# EAGLE design WizFi_Baseboard (EAGLE 6.1)
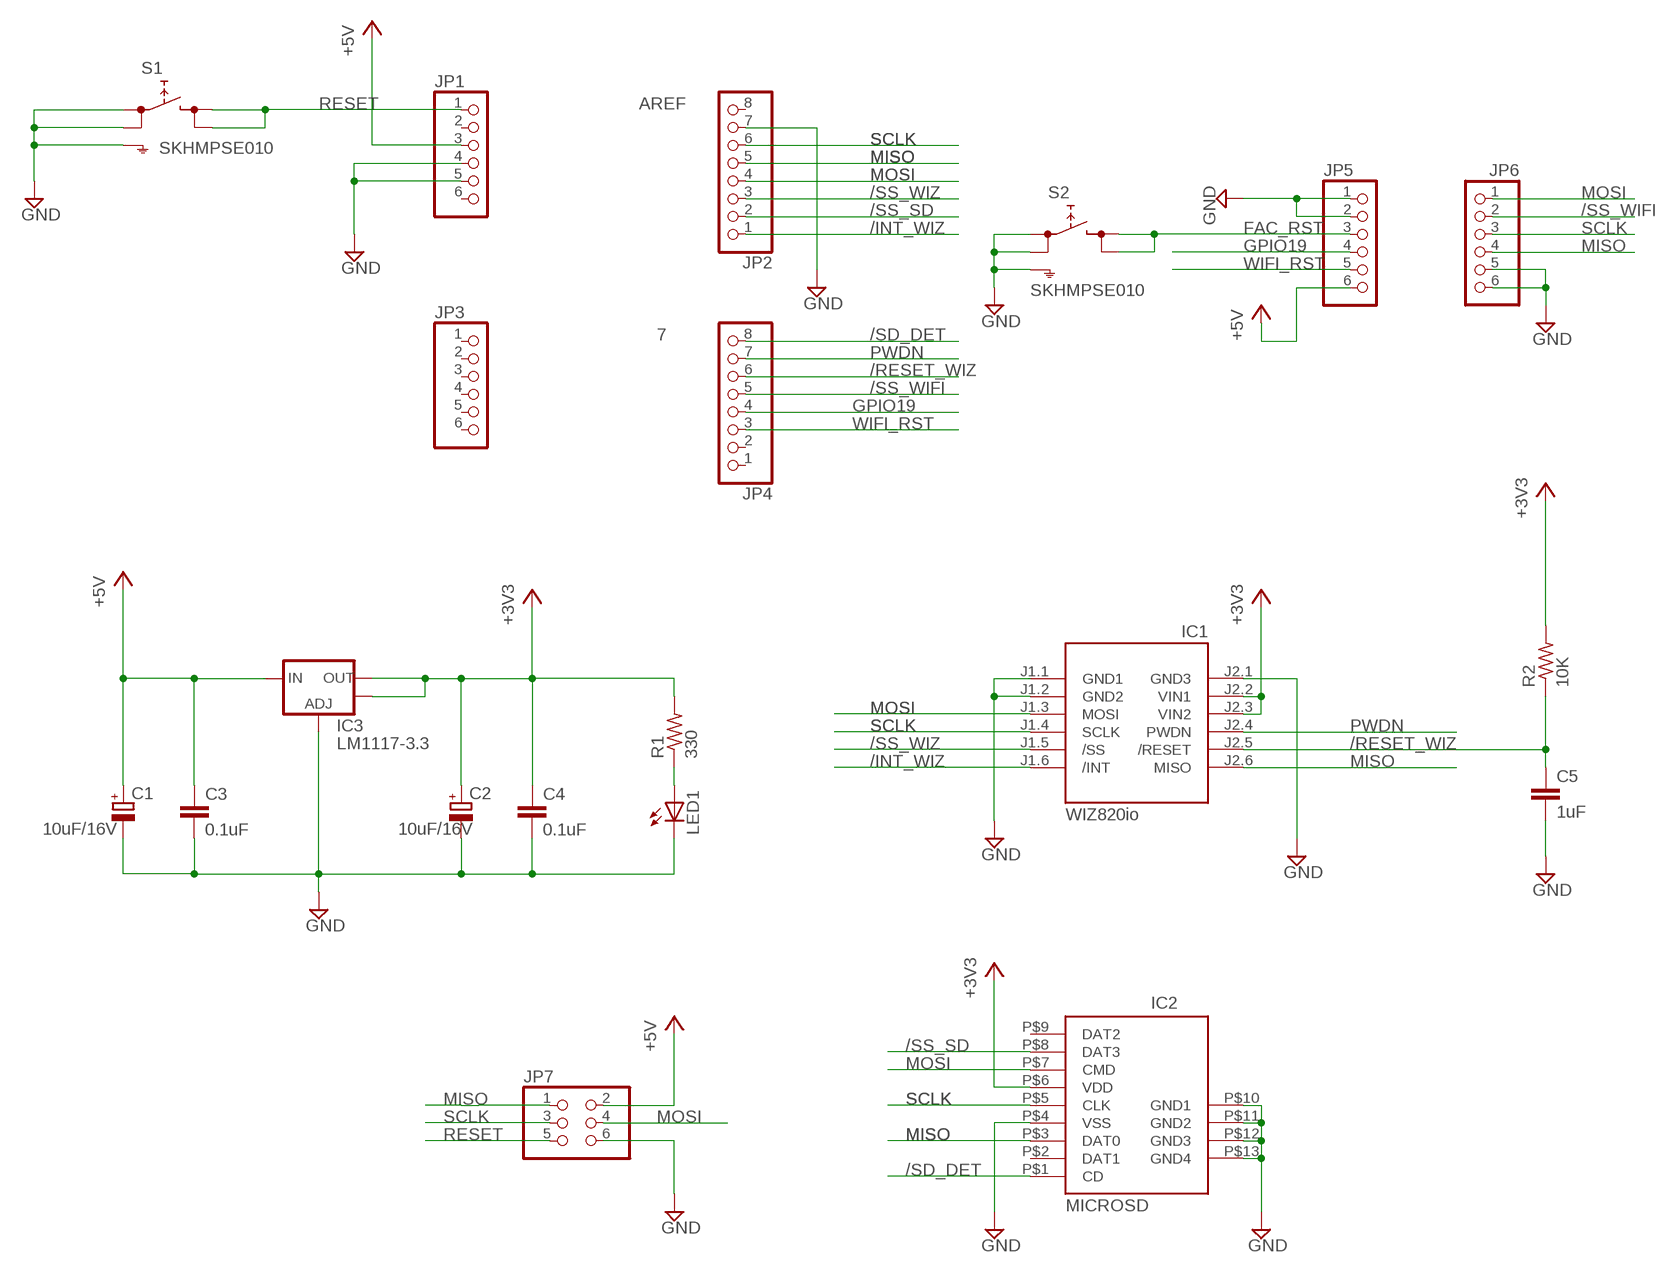
[diagram p0: schematic, sheet 1]

## Parts
C1  10uF/16V  CPOL-EUCT3216  [CT3216]
C2  10uF/16V  CPOL-EUCT3216  [CT3216]
C3  0.1uF  C-EUC0805  [C0805]
C4  0.1uF  C-EUC0805  [C0805]
C5  1uF  C-EUC0805  [C0805]
IC1  WIZ820io  WIZ820IO_DEVICE'DUAL-IN-LINE-STAMP'  [WIZ820IO]
IC2  MICROSD  [MSDPAC]
IC3  LM1117-3.3  V_REG_LM1117SOT223  [SOT223]
JP1  PINHD-1X6  [1X06]
JP2  PINHD-1X8  [1X08]
JP3  PINHD-1X6  [1X06]
JP4  PINHD-1X8  [1X08]
JP5  PINHD-1X6  [1X06]
JP6  PINHD-1X6  [1X06]
JP7  PINHD-2X3  [2X03]
LED1  LEDCHIP-LED0805  [CHIP-LED0805]
R1  330  R-US_R0805  [R0805]
R2  10K  R-US_R0805  [R0805]
S1  SKHMPSE010  [SKHMPXE010]
S2  SKHMPSE010  [SKHMPXE010]

## Nets
+3V3: C2.+ C4.1 IC1.J2.2(VIN1) IC1.J2.3(VIN2) IC2.P$6(VDD) IC3.2(OUT) IC3.4(OUT) R1.2 R2.2
+5V: C1.+ C3.1 IC3.3(IN) JP1.3 JP5.6 JP7.2
/INT_WIZ: IC1.J1.6(/INT) JP2.1
/RESET_WIZ: C5.1 IC1.J2.5(/RESET) JP4.6 R2.1
/SD_DET: IC2.P$1(CD) JP4.8
/SS_SD: IC2.P$8(DAT3) JP2.2
/SS_WIFI: JP4.5 JP6.2
/SS_WIZ: IC1.J1.5(/SS) JP2.3
FAC_RST: JP5.3 S2.3(2.1) S2.4(2.2)
GND: C1.- C2.- C3.2 C4.2 C5.2 IC1.J1.1(GND1) IC1.J1.2(GND2) IC1.J2.1(GND3) IC2.P$4(VSS) IC2.P$10(GND1) IC2.P$11(GND2) IC2.P$12(GND3) IC2.P$13(GND4) IC3.1(ADJ) JP1.4 JP1.5 JP2.7 JP5.1 JP5.2 JP6.5 JP6.6 JP7.6 LED1.C S1.1(1.1) S1.2(1.2) S1.5(SH) S2.1(1.1) S2.2(1.2) S2.5(SH)
GPIO19: JP4.4 JP5.4
MISO: IC1.J2.6(MISO) IC2.P$3(DAT0) JP2.5 JP6.4 JP7.1
MOSI: IC1.J1.3(MOSI) IC2.P$7(CMD) JP2.4 JP6.1 JP7.4
N$15: LED1.A R1.1
PWDN: IC1.J2.4(PWDN) JP4.7
RESET: JP1.1 JP7.5 S1.3(2.1) S1.4(2.2)
SCLK: IC1.J1.4(SCLK) IC2.P$5(CLK) JP2.6 JP6.3 JP7.3
WIFI_RST: JP4.3 JP5.5
Unconnected: IC2.P$2(DAT1) IC2.P$9(DAT2) JP1.2 JP1.6 JP2.8 JP3.1 JP3.2 JP3.3 JP3.4 JP3.5 JP3.6 JP4.1 JP4.2

## Notes on the sheet
- AREF
- SCLK
- MISO
- MOSI
- 7
- MOSI
- SCLK
- SCLK
- MISO

## Library data of the parts
C1 C2 = rcl:CPOL-EU: POLARIZED CAPACITOR, European symbol
C3-C5 = rcl:C-EU: CAPACITOR, European symbol
IC1 = wiz820io:WIZ820IO_DEVICE: WIZnet, WIZ820io plug in module incl. W5200 chip and MagJack
IC2 = msd_symbol:MICROSD
IC3 = SparkFun:V_REG_LM1117: Voltage Regulator LM1117 Standard adjustable voltage regulator but in SMD form. Spark Fun Electronics SKU : COM-00595
JP1 JP3 JP5 JP6 = pinhead:PINHD-1X6: PIN HEADER
JP2 JP4 = pinhead:PINHD-1X8: PIN HEADER
JP7 = pinhead:PINHD-2X3: PIN HEADER
LED1 = led:LED: LED OSRAM: - CHIPLED LG R971, LG N971, LY N971, LG Q971, LY Q971, LO R971, LY R971 LH N974, LH R974 LS Q976, LO Q976, LY Q976 LO Q996 - Hyper CHIPLED LW Q18S LB Q993, LB Q99A, LB R99A - SideLED LS A670, LO A670, LY A670, LG A670, LP A670 LB A673, LV A673, LT A673, LW A673 LH A674 LY A675 LS A676, LA A676, LO A676, LY A676, LW A676 LS A679, LY A679, LG A679 - Hyper Micro SIDELED® LS Y876, LA Y876, LO Y876, LY Y876 LT Y87S - SmartLED LW L88C, LW L88S LB L89C, LB L89S, LG L890 LS L89K, LO L89K, LY L89K LS L896, LA L896, LO L896, LY L896 - TOPLED LS T670, LO T670, LY T670, LG T670, LP T670 LSG T670, LSP T670, LSY T670, LOP T670, LYG T670 LG T671, LOG T671, LSG T671 LB T673, LV T673, LT T673, LW T673 LH T674 LS T676, LA T676, LO T676, LY T676, LB T676, LH T676, LSB T676, LW T676 LB T67C, LV T67C, LT T67C, LS T67K, LO T67K, LY T67K, LW E67C LS E67B, LA E67B, LO E67B, LY E67B, LB E67C, LV E67C, LT E67C LW T67C LS T679, LY T679, LG T679 LS T770, LO T770, LY T770, LG T770, LP T770 LB T773, LV T773, LT T773, LW T773 LH T774 LS E675, LA E675, LY E675, LS T675 LS T776, LA T776, LO T776, LY T776, LB T776 LHGB T686 LT T68C, LB T68C - Hyper Mini TOPLED® LB M676 - Mini TOPLED Santana® LG M470 LS M47K, LO M47K, LY M47K Source: http://www.osram.convergy.de LUXEON: - LUMILED® LXK2-PW12-R00, LXK2-PW12-S00, LXK2-PW14-U00, LXK2-PW14-V00 LXK2-PM12-R00, LXK2-PM12-S00, LXK2-PM14-U00 LXK2-PE12-Q00, LXK2-PE12-R00, LXK2-PE12-S00, LXK2-PE14-T00, LXK2-PE14-U00 LXK2-PB12-K00, LXK2-PB12-L00, LXK2-PB12-M00, LXK2-PB14-N00, LXK2-PB14-P00, LXK2-PB14-Q00 LXK2-PR12-L00, LXK2-PR12-M00, LXK2-PR14-Q00, LXK2-PR14-R00 LXK2-PD12-Q00, LXK2-PD12-R00, LXK2-PD12-S00 LXK2-PH12-R00, LXK2-PH12-S00 LXK2-PL12-P00, LXK2-PL12-Q00, LXK2-PL12-R00 Source: www.luxeon.com KINGBRIGHT: KA-3528ASYC Source: www.kingbright.com
R1 R2 = resistor:R-US_: RESISTOR, American symbol
S1 S2 = switch:SKHMP*E010: 6.2 X 6.5mm TACT Switch (SMD) Source: http://www3.alps.co.jp/WebObjects/catalog.woa/PDF/E/Switch/Tact/SKHM/SKHM.PDF

## Board
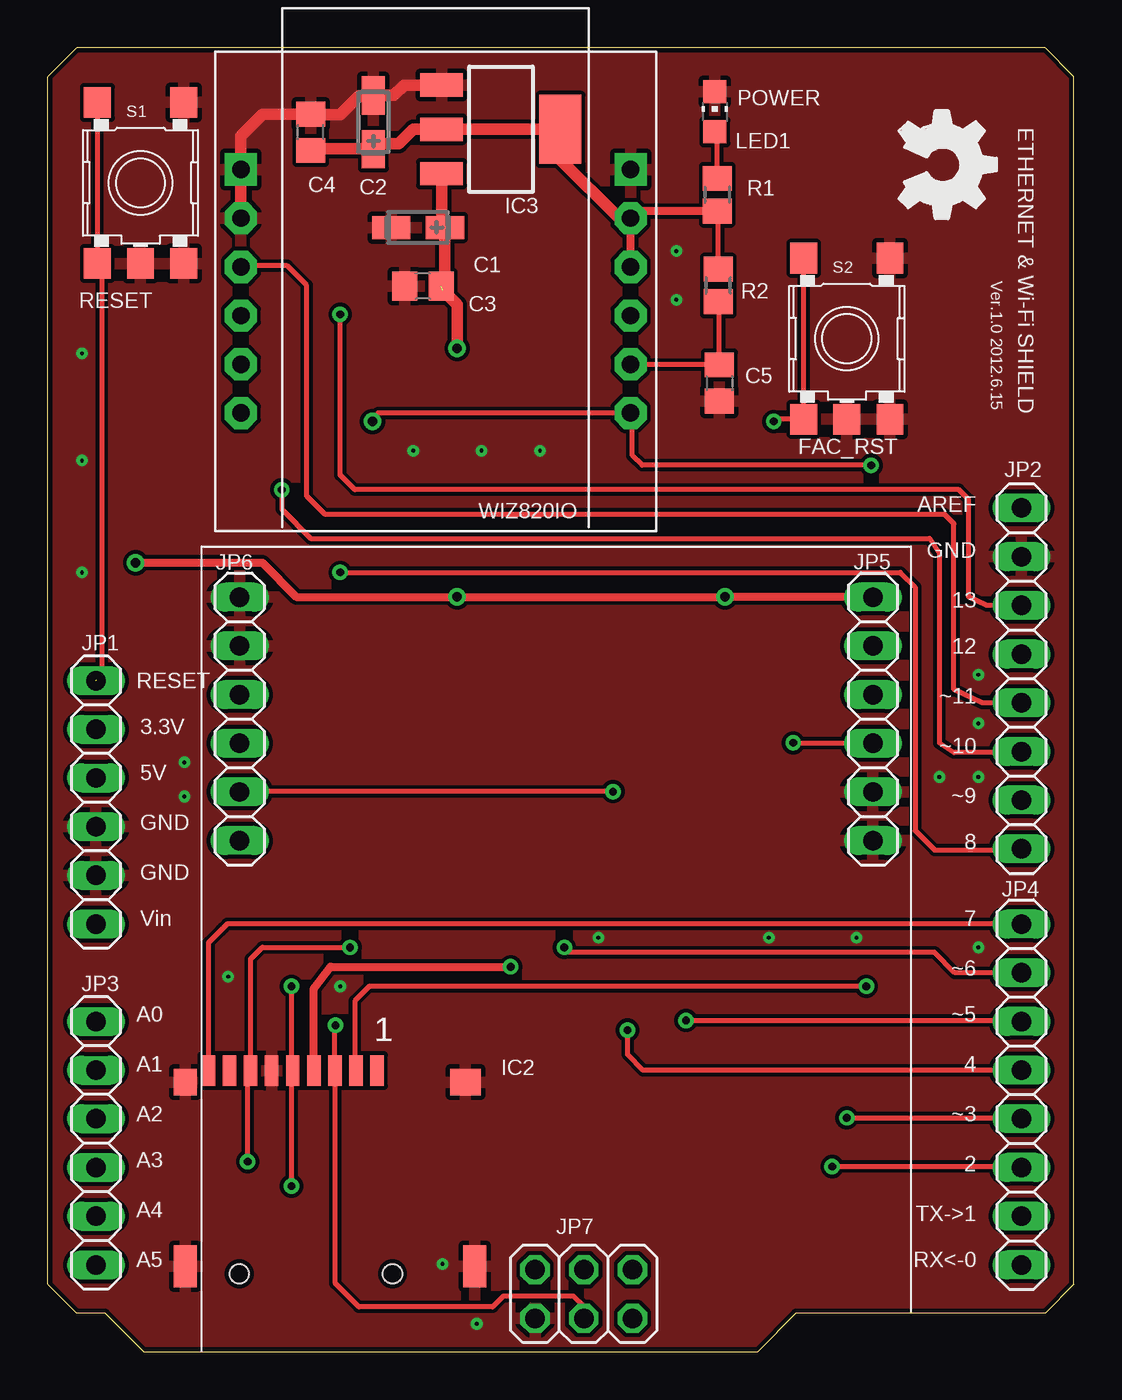
[diagram p1: board, top side]
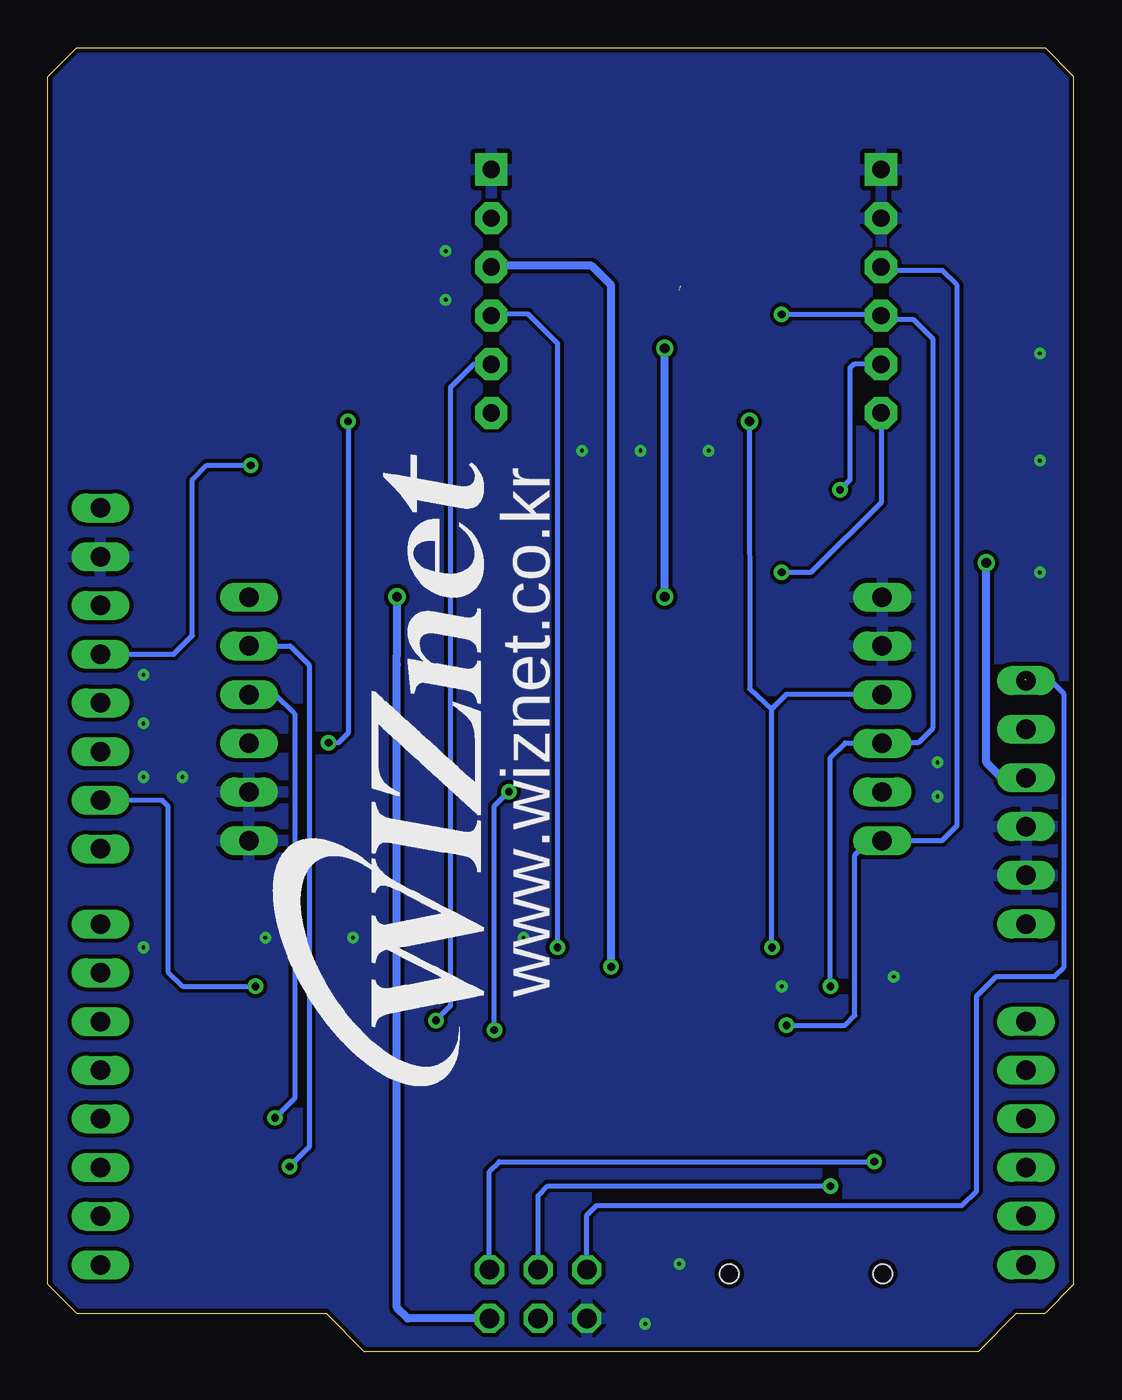
[diagram p2: board, bottom side, seen from below]

Size 53.5 x 68 mm. Coordinates in mm from the lower left corner, seen from the top.
Outline: 52,68 1.5,68 0,66.5 0,3.5 1.5,2 3,2 5,0 37,0 39,2 52,2 53.5,3.5 53.5,66.5 52,68
Copper layers (1*16): Top 0.035mm / dielectric 1.5mm / Bottom 0.035mm
Design rules: minimum track width 10mil, minimum drill 4mil, track to track 8mil, track to pad 8mil, pad to pad 8mil, via to via 8mil, smd to smd 8mil, copper to edge 10mil, drill to drill 8mil, minimum pad ring 10mil, minimum via ring 8mil, stop-mask expansion 4mil, vias tented up to drill 0mil, thermal gap 10mil

### Footprints (pad centres in the part's own frame; a part is rotated, then mirrored left to right if it is on the bottom)
CT3216 = smd 2 x 1.2: + -1.4,0; - 1.4,0
C0805 = smd 1.3 x 1.5: 1 -0.95,0; 2 0.95,0
WIZ820IO = drill 0.9 pad 1.676 square: J1.1 -10.16,6.35; J2.1 10.16,6.35 | drill 0.9 pad 1.676 octagon: J1.2 -10.16,3.81; J1.3 -10.16,1.27; J1.4 -10.16,-1.27; J1.5 -10.16,-3.81; J1.6 -10.16,-6.35; J2.2 10.16,3.81; J2.3 10.16,1.27; J2.4 10.16,-1.27; J2.5 10.16,-3.81; J2.6 10.16,-6.35
MSDPAC = smd 0.7 x 1.6: P$1 0,0; P$2 1.1,0; P$3 2.2,0; P$4 3.3,0; P$5 4.4,0; P$6 5.5,0; P$7 6.6,0; P$8 7.7,0; P$9 8.8,0 | smd 1.2 x 1.4: P$10 -1.2,-0.6 | smd 1.6 x 1.4: P$11 13.4,-0.6 | smd 1.2 x 2.2: P$12 13.9,-10.2; P$13 -1.2,-10.2 | hole 1: 9.6,-10.6; 1.6,-10.6
SOT223 = smd 1.219 x 2.235: 1 -2.311,-3.099; 2 0,-3.099; 3 2.311,-3.099 | smd 3.6 x 2.2: 4 0,3.099
1X06 = drill 1.016 long: 1 -6.35,0; 2 -3.81,0; 3 -1.27,0; 4 1.27,0; 5 3.81,0; 6 6.35,0
1X08 = drill 1.016 long: 1 -8.89,0; 2 -6.35,0; 3 -3.81,0; 4 -1.27,0; 5 1.27,0; 6 3.81,0; 7 6.35,0; 8 8.89,0
2X03 = drill 1.016 octagon: 1 -2.54,-1.27; 2 -2.54,1.27; 3 0,-1.27; 4 0,1.27; 5 2.54,-1.27; 6 2.54,1.27
CHIP-LED0805 = smd 1.2 x 1.2: A 0,-1.05; C 0,1.05
R0805 = smd 1.3 x 1.5: 1 -0.85,0; 2 0.85,0
SKHMPXE010 = smd 1.6 x 1.4: 1 -4.2,2.25; 2 4.2,2.25; 3 -4.2,-2.25; 4 4.2,-2.25; 5 4.2,0

### Placement (x,y rotation side)
C1  19.3,58.64 180 top
C2  16.97,64.12 90 top
C3  19.55,55.57 180 top
C4  13.7,63.6 90 top
C5  35.01,50.52 270 top
IC1  20.22,55.31 0 top
IC2  8.37,14.65 0 top
IC3  23.62,63.75 270 top
JP1  2.5,28.65 270 top
JP2  50.76,35.11 90 top
JP3  2.5,10.87 270 top
JP4  50.76,13.41 90 top
JP5  43.02,33 90 top
JP6  10,33 90 top
JP7  27.94,3 180 top
LED1  34.77,64.67 0 top
R1  34.89,60.34 270 top
R2  34.95,55.61 90 top
S1  4.83,60.96 270 top
S2  41.66,52.83 270 top
U$1  [OSHW_FILLX200_NOTEXT]  44.37,64.75 270 top
U$2  [WIZNET_LOGO_PAC]  33.73,29.06 90 bottom

### Tracks (layer width: path | path; a pad name or v marks a point on that pad's centre or on a via)
+3V3  (via drill 0.4)
  Top 0.254: R2.2 34.95,59.44
  Top 0.406: 34.95,59.44 R1.2 30.75,59.49 IC1.J2.2 IC1.J2.3 | IC2.P$6 13.87,18.95 14.73,20.07 v24.13,20.07
  Top 0.61: IC1.J2.2 29.78,59.12 26.72,62.18 IC3.4 IC3.2 19.05,63.75 18.29,62.99 17.24,62.99 C2.+ 16.78,62.72 16.76,62.74 13.78,62.74 C4.1
  Bottom 0.406: v24.13,20.07 24.13,55.63 25.15,56.64 30.48,56.64 30.42,56.58 IC1.J2.3
+5V  (via drill 0.5)  (1 unrouted)
  Top 0.406: v4.57,41.15 11.18,41.15 12.95,39.37 v21.34,39.37 | JP5.6 35.33,39.35 v35.31,39.37 35.29,39.35 21.36,39.35
  Top 0.61: 20.8,55.87 C3.1 20.7,55.77 C1.+ 20.52,58.81 IC3.3 | 21.36,39.35 v21.34,39.37 | v21.34,52.32 21.34,54.61 20.57,55.37
  Bottom 0.406: v21.34,39.37 v21.34,52.32 | JP1.3 3.76,29.92 4.57,30.73 v4.57,41.15 | JP7.2 34.75,1.73 35.31,2.29 35.31,35.81 35.31,36.32 v35.31,39.37
/INT_WIZ  (via drill 0.4)
  Top 0.254: v15.24,40.64 44.45,40.64 45.21,39.88 45.21,27.18 46.23,26.16 50.7,26.16 JP2.1
  Bottom 0.254: IC1.J1.6 10.06,44.3 13.72,40.64 v15.24,40.64
/RESET_WIZ  (via drill 0.4)
  Top 0.254: 35.01,54.7 C5.1 30.41,51.47 | v33.27,17.27 50.71,17.27 JP4.6
  Top 0.406: 35.01,54.7 R2.1 | 30.41,51.47 IC1.J2.5
  Bottom 0.254: IC1.J2.5 31.3,51.5 32.51,50.29 32.51,18.03 v33.27,17.27
/SD_DET
  Top 0.254: 8.38,14.65 8.38,21.34 9.02,21.97 9.14,22.1 9.35,22.3 JP4.8
  Top 0.406: IC2.P$1 8.38,14.65
/SS_SD  (via drill 0.4)
  Top 0.254: 16.26,14.73 16.18,14.65 IC2.P$8 16,14.72 16,18.29 16.76,19.05 v42.67,19.05
  Bottom 0.254: JP2.2 47.56,28.76 47.24,28.45 47.24,19.81 46.48,19.05 v42.67,19.05
/SS_WIFI  (via drill 0.4)
  Top 0.254: JP4.5 31.04,14.68 30.23,15.49 v30.23,16.76 | v29.46,29.21 10.16,29.21 10.14,29.19 JP6.2
  Bottom 0.254: v30.23,16.76 30.23,28.45 v29.46,29.21
/SS_WIZ  (via drill 0.4)
  Top 0.254: JP2.3 50.7,31.24 47.24,31.24 46.48,31.75 46.48,41.66 45.97,42.42 13.72,42.42 12.19,43.94 v12.19,44.96
  Bottom 0.254: IC1.J1.5 11.49,51.5 11.68,51.31 11.68,45.47 v12.19,44.96
FAC_RST  (via drill 0.4)
  Top 0.254: v37.85,48.51 37.85,48.63 S2.4 S2.3 | v38.86,31.75 43,31.75 JP5.3
  Bottom 0.254: v37.85,48.51 37.85,32.26 38.35,31.75 v38.86,31.75
GND  (via drill 0.2)
  Top 0.61: IC3.1 18.57,66.06 18.03,65.53 16.98,65.53 C2.- 16.24,65.52 15.24,64.52 13.73,64.52 C4.2 11.21,64.55 10.06,63.4 IC1.J1.1 IC1.J1.2
  other vias: 9.4,19.56 28.7,21.59 37.59,21.59 42.16,21.59 48.51,21.08 48.51,29.97 48.51,32.77 46.48,29.97 48.51,35.31 32.77,57.4 32.77,54.86 19.05,46.99 22.61,46.99 25.65,46.99 15.24,19.05 22.36,1.45 20.57,4.57 7.11,30.73 7.11,28.96 1.78,40.64 1.78,46.48 1.78,52.07
  pour Top: -2.03,69.34 -2.03,-2.03 54.86,-2.03 54.86,70.1 -2.03,70.1 -2.03,69.6
  pour Bottom: -2.03,69.09 -2.03,-0.25 53.85,-0.25 53.85,69.85 -2.03,69.85
GPIO19  (via drill 0.4)
  Top 0.254: v41.66,12.19 50.71,12.19 JP4.4
  Bottom 0.254: JP5.4 41.64,34.27 40.64,33.27 40.64,13.21 v41.66,12.19
MISO  (via drill 0.4, 0.5)
  Top 0.254: v16.92,48.51 17.21,48.96 IC1.J2.6 30.48,48.86 30.48,46.74 30.99,46.23 v42.93,46.23 | IC2.P$3 10.57,20.47 11.18,21.08 v15.75,21.08 | v10.41,9.91 10.41,14.48
  Top 0.406: 10.41,14.48 10.57,14.48 IC2.P$3
  Bottom 0.254: v15.75,21.08 15.75,33.53 | 15.75,33.53 14.99,34.29 10.02,34.29 JP6.4 | v16.92,48.51 16.91,34.57 15.75,33.53 | JP2.5 46.93,36.38 45.97,37.34 45.97,45.47 45.21,46.23 v42.93,46.23 | JP7.1 30.48,9.4 29.97,9.91 v10.41,9.91
MOSI  (via drill 0.4)
  Top 0.254: JP2.4 48.71,33.84 47.24,34.54 47.24,43.18 46.74,43.69 14.43,43.69 13.49,44.62 13.49,55.63 12.47,56.64 10.12,56.64 | v14.99,17.02 14.97,17 IC2.P$7 14.99,14.63 14.99,3.56 16.21,2.33 23.19,2.33 23.75,2.89 27.4,2.89 27.94,2.35 JP7.4
  Top 0.406: 10.12,56.64 IC1.J1.3
  Bottom 0.254: 10.16,55.88 IC1.J1.3 10.06,56.64 10.16,56.64 9.91,56.39 6.86,56.39 6.1,55.63 6.1,27.43 6.88,26.65 JP6.1 10.02,26.67 10.67,26.67 11.43,25.91 11.43,17.53 11.94,17.02 v14.99,17.02
N$15
  Top 0.254: R1.1 34.89,63.5
  Top 0.406: 34.89,63.5 LED1.A
PWDN  (via drill 0.4)
  Top 0.254: JP4.7 47.3,19.76 46.23,20.83 27.18,20.83 v26.92,21.08
  Bottom 0.254: v26.92,21.08 26.92,52.58 28.45,54.1 30.32,54.1 IC1.J2.4
RESET  (1 unrouted)
  Top 0.254: S1.3 S1.4 2.07,56.68 2.03,56.64 2.79,56.64 2.79,35.31 2.54,35.05
  Bottom 0.254: JP7.5 25.4,7.11 24.89,7.62 5.84,7.62 5.08,8.38 5.08,18.54 4.06,19.56 1.02,19.56 0.51,20.07 0.51,34.29 1.27,35.05 2.45,35.05 JP1.1
SCLK  (via drill 0.4)
  Top 0.254: JP2.6 48.96,38.92 48.01,39.37 48.01,44.45 47.5,44.96 16,44.96 15.24,45.72 v15.24,54.1 | v12.7,19.05 12.7,14.65 IC2.P$5 12.7,14.46 v12.7,8.64
  Bottom 0.254: IC1.J1.4 10.06,53.95 10.16,53.85 | 10.16,53.85 8.38,53.85 7.37,52.83 7.37,32.51 8.13,31.75 8.89,31.75 | 8.89,31.75 9.91,31.75 | v15.24,54.1 10.41,54.1 10.16,53.85 | 8.89,31.75 JP6.3 10.02,31.75 11.94,31.75 12.7,30.99 v12.7,19.05 | JP7.3 27.94,8.13 27.43,8.64 v12.7,8.64
WIFI_RST  (via drill 0.4)
  Top 0.254: v40.89,9.65 50.71,9.65 JP4.3
  Bottom 0.254: JP5.5 40.87,36.81 39.88,35.81 39.88,10.67 v40.89,9.65

### Text on the board
bPlace: www.wiznet.co.kr
tNames: POWER | RESET | Ver.1.0 2012.6.15 | ETHERNET & Wi-Fi SHIELD | FAC_RST | AREF | WIZ820IO | GND | 13 | 12 | RESET | ~11 | 3.3V | ~10 | 5V | ~9 | GND | 8 | GND | Vin | 7 | ~6 | A0 | ~5 | A1 | 4 | A2 | ~3 | A3 | 2 | A4 | TX->1 | A5 | RX<-0